# EasyEDA Pro project STM32F722.eprj, schematic InFlight P1
Board Name: Board1; Create Date: 2025-01-12; Page Name: Internal Schematic; Project Name: STM32F722; Schematic Name: InFlight P1; Update Date: 2025-01-13; Company: EASY EDA; Page Size: A4; Version: V1.0
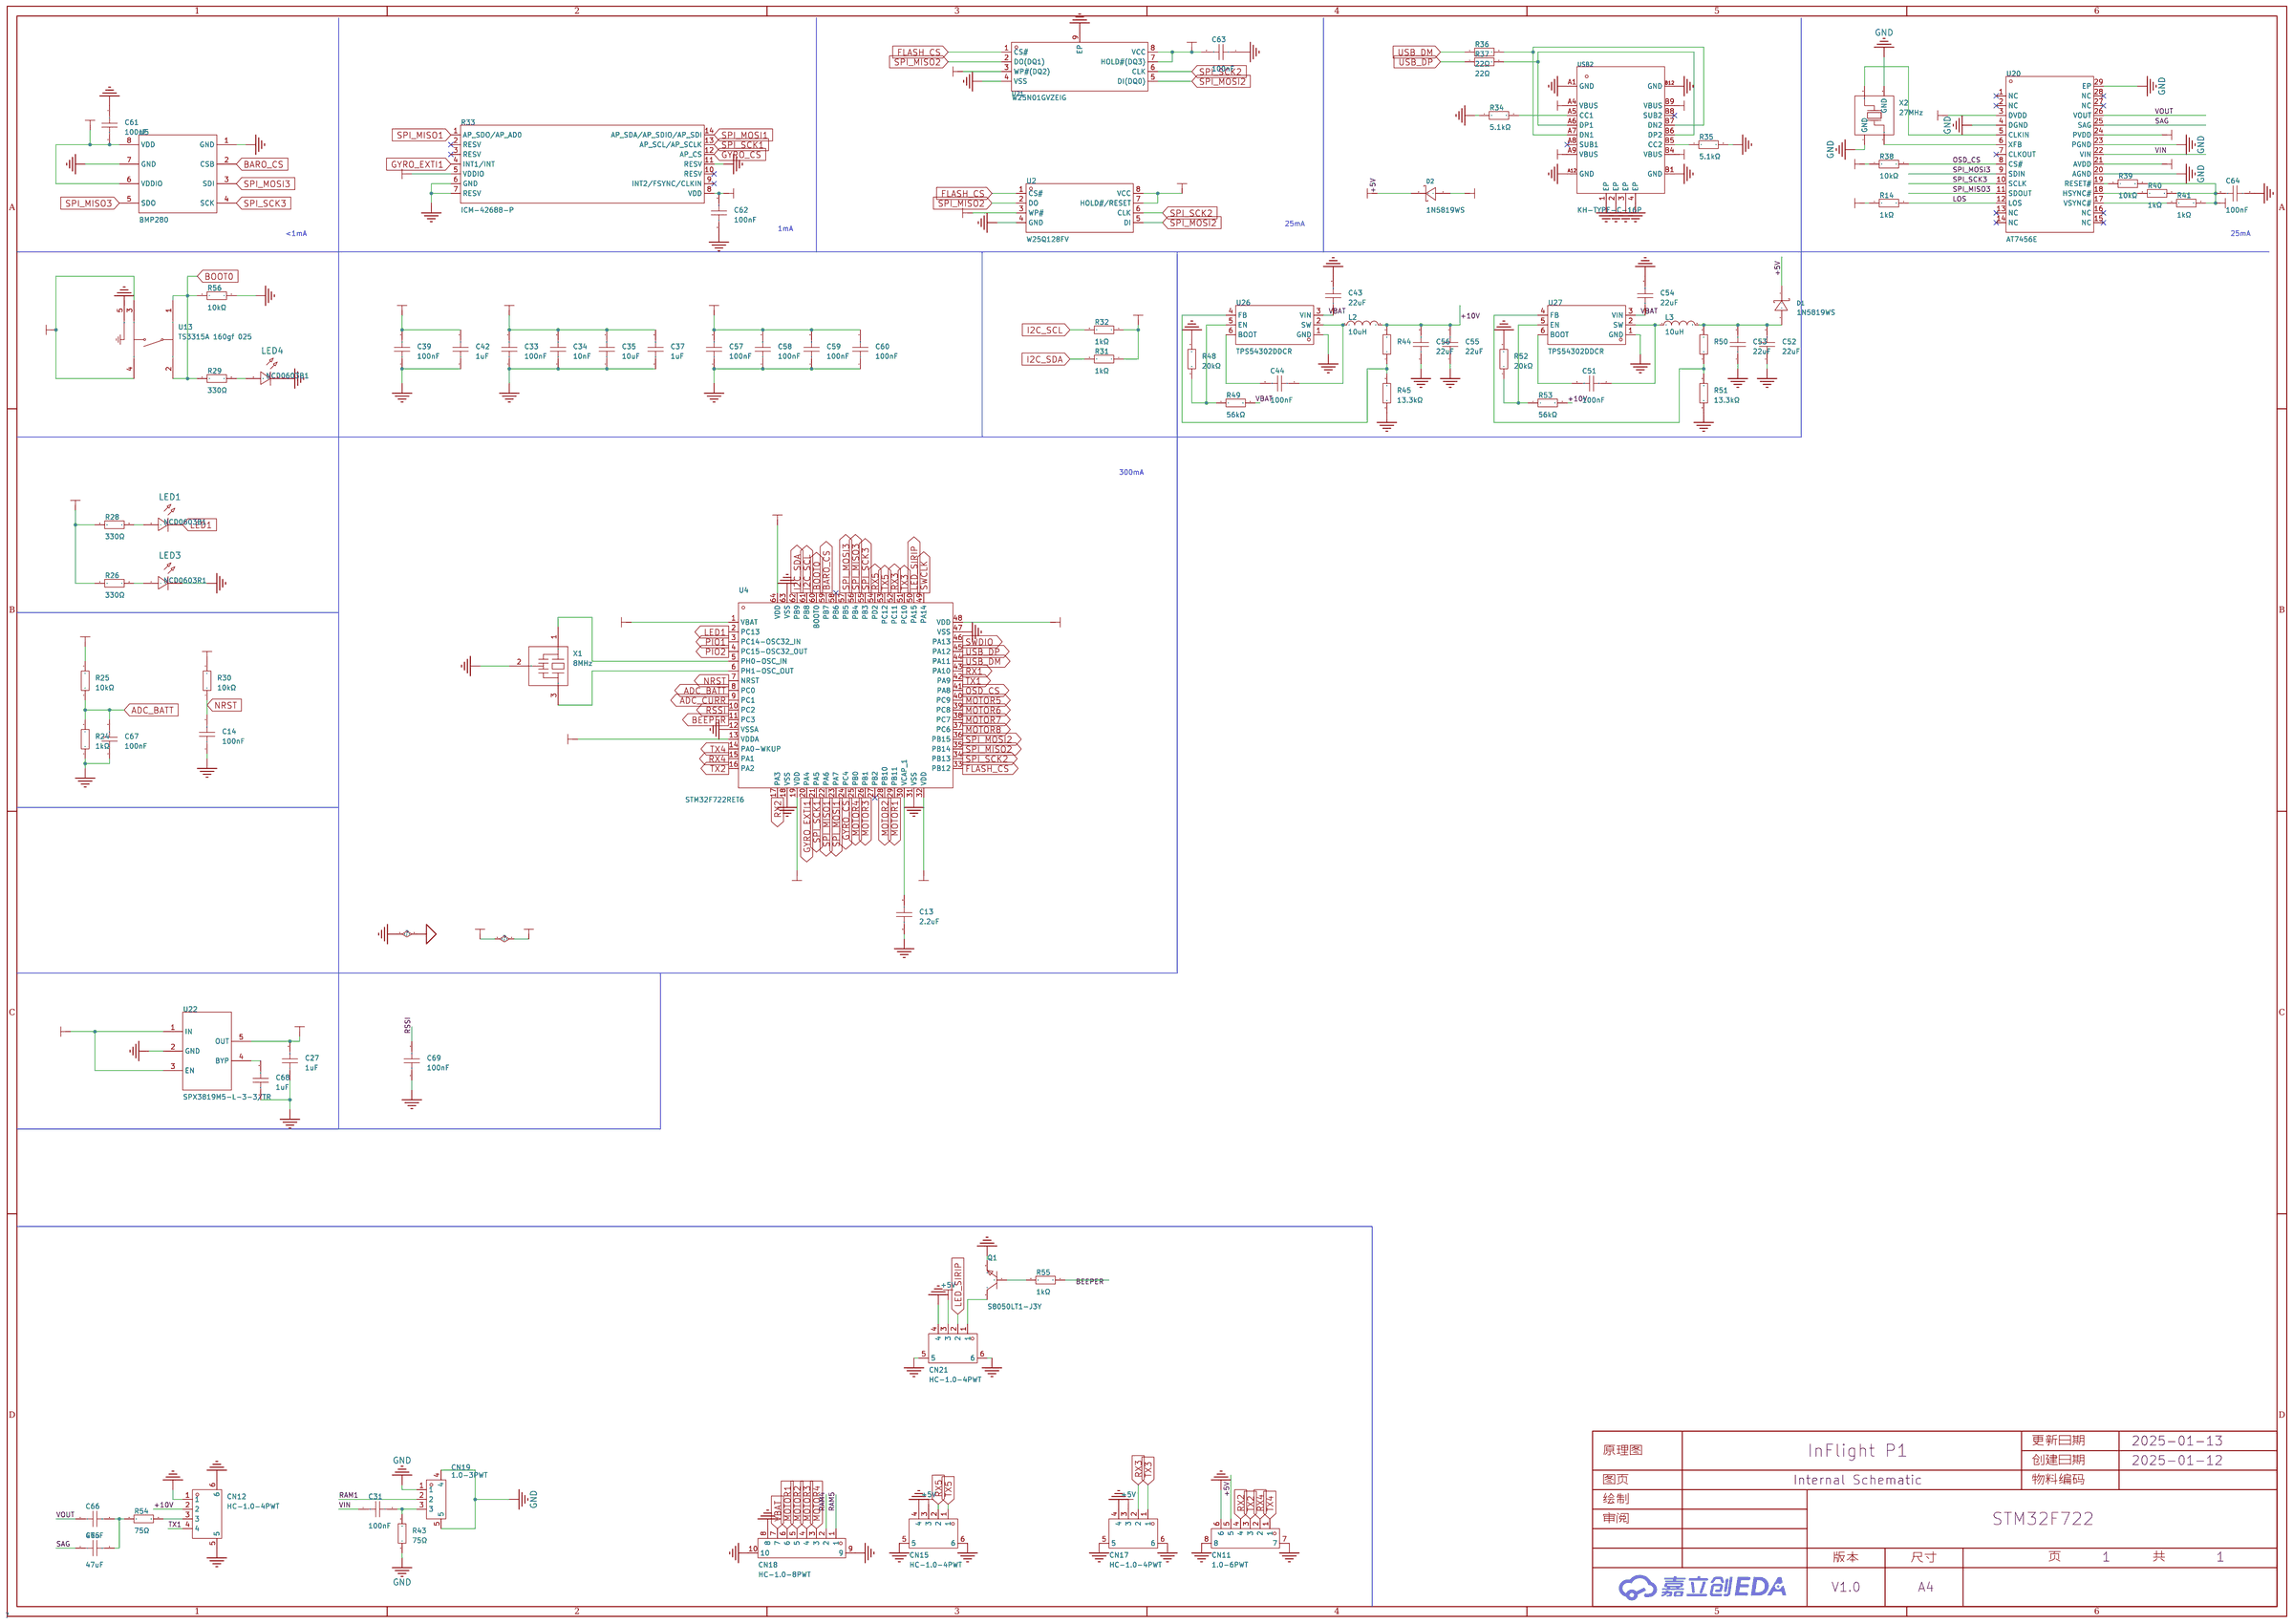
[diagram p0: schematic sheet]

## Parts
C13  2.2uF  [C0402]
C14  100nF  [C0402]
C27  1uF  [C0402]
C31  100nF  [C0402]
C33  100nF  [C0402]
C34  10nF  [C0402]
C35  10uF  [C0402]
C37  1uF  [C0402]
C39  100nF  [C0402]
C42  1uF  [C0402]
C43  22uF  [C0805]
C44  100nF  [C0402]
C51  100nF  [C0402]
C52  22uF  [C0603]
C53  22uF  [C0603]
C54  22uF  [C0805]
C55  22uF  [C0805]
C56  22uF  [C0805]
C57  100nF  [C0402]
C58  100nF  [C0402]
C59  100nF  [C0402]
C60  100nF  [C0402]
C61  100nF  [C0402]
C62  100nF  [C0402]
C63  100nF  [C0402]
C64  100nF  [C0402]
C65  47uF  [C1206]
C66  47uF  [C1206]
C67  100nF  [C0402]
C68  1uF  [C0402]
C69  100nF  [C0402]
CN11  1.0-6PWT  [CONN-SMD_1.0-6PWT]
CN12  HC-1.0-4PWT  [CONN-SMD_4P-P1.00_HCTL_HC-1.0-4PWT]
CN15  HC-1.0-4PWT  [CONN-SMD_4P-P1.00_HCTL_HC-1.0-4PWT]
CN17  HC-1.0-4PWT  [CONN-SMD_4P-P1.00_HCTL_HC-1.0-4PWT]
CN18  HC-1.0-8PWT  [CONN-SMD_HC-1.0-8PWT]
CN19  1.0-3PWT  [CONN-SMD_1.0-3PWT]
CN21  HC-1.0-4PWT  [CONN-SMD_4P-P1.00_HCTL_HC-1.0-4PWT]
D1  1N5819WS  [SOD-323_L1.8-W1.3-LS2.5-RD]
D2  1N5819WS  [SOD-323_L1.8-W1.3-LS2.5-RD]
L2  10uH  [IND-SMD_L4.4-W4.2]
L3  10uH  [IND-SMD_L4.4-W4.2]
LED1  NCD0603B1  [LED0603-RD]
LED3  NCD0603R1  [LED0603-RD_RED]
LED4  NCD0603B1  [LED0603-RD]
Q1  S8050LT1-J3Y  [SOT-23_L2.9-W1.3-P1.90-LS2.4-BR]
R14  1kΩ  [R0402]
R24  1kΩ  [R0402]
R25  10kΩ  [R0402]
R26  330Ω  [R0402]
R28  330Ω  [R0402]
R29  330Ω  [R0402]
R30  10kΩ  [R0402]
R31  1kΩ  [R0402]
R32  1kΩ  [R0402]
R33  ICM-42688-P  [LGA-14_L3.0-W2.5-P0.50-TL]
R34  5.1kΩ  [R0402]
R35  5.1kΩ  [R0402]
R36  22Ω  [R0402]
R37  22Ω  [R0402]
R38  10kΩ  [R0402]
R39  10kΩ  [R0402]
R40  1kΩ  [R0402]
R41  1kΩ  [R0402]
R43  75Ω  [R0402]
R44  200kΩ  [R0402]
R45  13.3kΩ  [R0402]
R48  20kΩ  [R0402]
R49  56kΩ  [R0402]
R50  100kΩ  [R0402]
R51  13.3kΩ  [R0402]
R52  20kΩ  [R0402]
R53  56kΩ  [R0402]
R54  75Ω  [R0402]
R55  1kΩ  [R0402]
R56  10kΩ  [R0402]
U2  W25Q128FV  [SOIC-8_L5.3-W5.3-P1.27-LS8.0-BL]  (no BOM)
U4  STM32F722RET6  [LQFP-64_L10.0-W10.0-P0.50-LS12.0-BL]
U5  BMP280  [LGA-8_L2.5-W2.0-P0.65_AMP6127]
U13  TS3315A 160gf 025  [SW-SMD_4P-L3.4-W3.4-P2.00-LS4.0_TS3315A160GF]
U20  AT7456E  [TSSOP-28_L9.7-W4.4-P0.65-LS6.4-BL-EP-2]
U21  W25N01GVZEIG  [WSON-8_L8.0-W6.10-P1.27-BL-EP]
U22  SPX3819M5-L-3-3/TR  [SOT-23-5_L3.0-W1.7-P0.95-LS2.8-BL]
U26  TPS54302DDCR  [SOT-23-6_L2.9-W1.6-P0.95-LS2.8-BL]
U27  TPS54302DDCR  [SOT-23-6_L2.9-W1.6-P0.95-LS2.8-BL]
USB2  KH-TYPE-C-16P  [USB-C-SMD_KH-TYPE-C-16P]
X1  8MHz  [OSC-SMD_3P-L3.2-W1.3-P1.2-L]
X2  27MHz  [OSC-SMD_4P-L3.2-W2.5-BL]

## Library data of the parts
C13 = CL05A225MQ5NSNC: 容值:2.2uF;精度:±20%;额定电压:6.3V;材质(温度系数):X5R;; LCSC Part Name: 2.2uF ±20% 6.3V; Supplier Part: C12530; Manufacturer: SAMSUNG(三星); Supplier Footprint: 0402; JLCPCB Part Class: Basic Part; Datasheet: https://atta.szlcsc.com/upload/public/pdf/source/20160103/1457707666860.pdf; Supplier: LCSC; Tolerance: ±20%; Voltage Rated: 6.3V; Temperature Coefficient: X5R
C14 C31 C33 C39 C44 C51 C57-C64 C67 C69 = CC0402KRX7R7BB104: 容值:100nF;精度:±10%;额定电压:16V;材质(温度系数):X7R;; LCSC Part Name: 100nF ±10% 16V; Supplier Part: C60474; Manufacturer: YAGEO(国巨); Supplier Footprint: 0402; JLCPCB Part Class: Extended Part; Datasheet: https://atta.szlcsc.com/upload/public/pdf/source/20211223/9278FD768280B81DDBEF48FA36411A03.pdf; Supplier: LCSC; Tolerance: ±10%; Voltage Rated: 16V; Temperature Coefficient: X7R
C27 C37 C42 C68 = CL05A105KP5NNNC: 容值:1uF;精度:±10%;额定电压:10V;材质(温度系数):X5R;; LCSC Part Name: 1uF ±10% 10V; Supplier Part: C14445; Manufacturer: SAMSUNG(三星); Supplier Footprint: 0402; JLCPCB Part Class: Extended Part; Datasheet: https://atta.szlcsc.com/upload/public/pdf/source/20160103/1457707670698.pdf; Supplier: LCSC; Tolerance: ±10%; Voltage Rated: 10V; Temperature Coefficient: X5R
C34 = CC0402KRX7R9BB103: 容值:10nF;精度:±10%;额定电压:50V;材质(温度系数):X7R;; LCSC Part Name: 10nF ±10% 50V; Supplier Part: C60133; Manufacturer: YAGEO(国巨); Supplier Footprint: 0402; JLCPCB Part Class: Extended Part; Datasheet: https://atta.szlcsc.com/upload/public/pdf/source/20180224/C181747_15194369449651363981.pdf; Supplier: LCSC; Tolerance: ±10%; Voltage Rated: 50V; Temperature Coefficient: X7R
C35 = CL05A106MQ5NUNC: 容值:10uF;精度:±20%;额定电压:6.3V;材质(温度系数):X5R;; LCSC Part Name: 10uF ±20% 6.3V; Supplier Part: C15525; Manufacturer: SAMSUNG(三星); Supplier Footprint: 0402; JLCPCB Part Class: Basic Part; Datasheet: https://atta.szlcsc.com/upload/public/pdf/source/20220823/2B02EE04F8F211D38A52DCB16EB6BEBA.pdf; Supplier: LCSC; Tolerance: ±20%; Voltage Rated: 6.3V; Temperature Coefficient: X5R
C43 C54-C56 = CGA0805X5R226M350MT: 容值:22uF;精度:±20%;额定电压:35V;材质(温度系数):X5R;; LCSC Part Name: 22uF ±20% 35V; Supplier Part: C6119901; Manufacturer: HRE(芯声); Supplier Footprint: 0805; JLCPCB Part Class: Extended Part; Datasheet: https://atta.szlcsc.com/upload/public/pdf/source/20160218/1457707763339.pdf; Supplier: LCSC; Tolerance: ±20%; Voltage Rated: 35V; Temperature Coefficient: X5R
C52 C53 = CL10A226MO7JZNC: 容值:22uF;精度:±20%;额定电压:16V;材质(温度系数):X5R;; LCSC Part Name: 22uF ±20% 16V; Supplier Part: C2762594; Manufacturer: SAMSUNG(三星); Supplier Footprint: 0603; JLCPCB Part Class: Extended Part; Datasheet: https://atta.szlcsc.com/upload/public/pdf/source/20220811/0832C3B1C642040B023B7A6186895861.pdf; Supplier: LCSC; Tolerance: ±20%; Voltage Rated: 16V; Temperature Coefficient: X5R
C65 C66 = CL31A476MQHNNNE: 容值:47uF;精度:±20%;额定电压:6.3V;温度系数:X5R;; LCSC Part Name: 47uF ±20% 6.3V; Supplier Part: C68361; Manufacturer: SAMSUNG(三星); Supplier Footprint: 1206; JLCPCB Part Class: Extended Part; Datasheet: https://atta.szlcsc.com/upload/public/pdf/source/20161108/1478586405199.pdf; Supplier: LCSC; Tolerance: ±20%; Voltage Rated: 6.3V; Temperature Coefficient: X5R
CN11 = 1.0-6PWT: LCSC Part Name: 6P 1mm; Supplier Part: C2763616; Manufacturer: FG(富港); Supplier Footprint: SMD; JLCPCB Part Class: 扩展库; Datasheet: https://atta.szlcsc.com/upload/public/pdf/source/20210407/C2763612_BC19A2888F3D57031C069552FCD34E66.pdf; Supplier: LCSC
CN12 CN15 CN17 CN21 = HC-1.0-4PWT: 参考系列:-;间距:1mm;插针结构:1x4P;排数:1;每排PIN数:4;行距:-;公母:公型插针;安装方式:卧贴;额定电流:500mA;工作温度范围:-25℃~+85℃;; LCSC Part Name: 1mm 1x4P 卧贴; Supplier Part: C2845363; Manufacturer: HCTL(华灿天禄); Supplier Footprint: SMD,P=1mm; JLCPCB Part Class: 扩展库; Datasheet: https://atta.szlcsc.com/upload/public/pdf/source/20210728/C2845363_1F51BFD94B9715F37EC2DCD7F6BA530B.pdf; Supplier: LCSC; Pitch: 1mm; Pins Structure: 1x4P; Number of Rows: 1; Number of PINs Per Row: 4; Gender: 公型插针; Mounting Style: 卧贴; Current Rating (Max): 500mA; Operating Temperature Range: -25℃~+85℃
CN18 = HC-1.0-8PWT: 插针结构:1x8P;间距:1mm;公母:公;安装方式:卧贴;行距:-;排数:1;每排PIN数:8;参考系列:-;额定电流:500mA;工作温度范围:-25℃~+85℃;; LCSC Part Name: 1x8P 间距:1mm 卧贴; Supplier Part: C2845367; Manufacturer: HCTL(华灿天禄); Supplier Footprint: SMD,P=1mm; JLCPCB Part Class: 扩展库; Datasheet: https://atta.szlcsc.com/upload/public/pdf/source/20230707/696F47DD5B3D5495B4AB8BCE302E8A84.pdf; Supplier: LCSC; Pins Structure: 1x8P; Pitch: 1mm; Gender: 公; Mounting Style: 卧贴; Number of Rows: 1; Number of PINs Per Row: 8; Current Rating (Max): 500mA; Operating Temperature Range: -25℃~+85℃
CN19 = 1.0-3PWT: LCSC Part Name: 3P 1mm; Supplier Part: C2763613; Manufacturer: FG(富港); Supplier Footprint: SMD; JLCPCB Part Class: 扩展库; Datasheet: https://atta.szlcsc.com/upload/public/pdf/source/20210407/C2763612_BC19A2888F3D57031C069552FCD34E66.pdf; Supplier: LCSC
D1 D2 = 1N5819WS_C191023: 直流反向耐压(Vr):40V;平均整流电流(Io):1A;正向压降(Vf):600mV@1A;; Supplier Part: C191023; Manufacturer: Hottech(合科泰); Supplier Footprint: SOD-323; JLCPCB Part Class: Extended Part; Datasheet: https://atta.szlcsc.com/upload/public/pdf/source/20180614/C191023_3C6A6398B911F3A4C23E7538EE054643.pdf; Supplier: LCSC; Reverse Voltage (Vr): 40V; Average Rectified Current (Io): 1A; Forward Voltage (Vf@If): 600mV@1A
L2 L3 = FAUL0420-100MT: 电感值:10uH;精度:±20%;额定电流:1.6A;类型:一体成型电感;饱和电流(Isat):2A;; LCSC Part Name: 10uH ±20% 2A; Supplier Part: C3040387; Manufacturer: cjiang(长江微电); Supplier Footprint: SMD,4.2x4.4mm; JLCPCB Part Class: 扩展库; Datasheet: https://atta.szlcsc.com/upload/public/pdf/source/20221201/43419F042EC034C99E4B70E898E2F3B3.pdf; Supplier: LCSC; Tolerance: ±20%; Rated Current: 1.6A; Type: 一体成型电感; DC Resistance (DCR): 282mΩ; Saturation Current (Isat): 2A; Ratings: AEC-Q200
LED1 LED4 = NCD0603B1: 发光颜色:蓝色;功率:72mW;透镜颜色:无色透明;主波长:463nm~475nm;发光强度:80mcd~220mcd;发光角度:130°;工作温度:-30℃~+85℃;; LCSC Part Name: 蓝灯 0603蓝灯   正贴; Supplier Part: C84266; Manufacturer: 国星光电; Supplier Footprint: 0603; JLCPCB Part Class: Extended Part; Datasheet: https://atta.szlcsc.com/upload/public/pdf/source/20200820/C84266_6A3CDBEFA72C6CAD68EDA53474ADAE6C.pdf; Supplier: LCSC; Emitted Color: 蓝色; Forward Voltage (VF): 2.6V~3.6V; Forward Current: 10mA; Power Dissipation: 72mW; Lens Color: 无色透明; Dominant Wavelength: 463nm~475nm; Luminous Intensity: 80mcd~220mcd; Viewing Angle: 130°; Operating Temperature: -30℃~+85℃
LED3 = NCD0603R1_C84263: 发光颜色:红色;功率:65mW;透镜颜色:无色透明;主波长:615nm~630nm;发光强度:80mcd~220mcd;发光角度:130°;工作温度:-30℃~+85℃;; LCSC Part Name: 红灯 0603红灯   正贴; Supplier Part: C84263; Manufacturer: 国星光电; Supplier Footprint: 0603; JLCPCB Part Class: Extended Part; Datasheet: https://atta.szlcsc.com/upload/public/pdf/source/20200820/C84263_DABC6A75E58F576973B407FDBA283D60.pdf; Supplier: LCSC; Emitted Color: 红色; Forward Voltage (VF): 1.6V~2.6V; Forward Current: 20mA; Power Dissipation: 65mW; Lens Color: 无色透明; Dominant Wavelength: 615nm~630nm; Luminous Intensity: 80mcd~220mcd; Viewing Angle: 130°; Operating Temperature: -30℃~+85℃
Q1 = S8050LT1-J3Y: Supplier Part: C2962087; Manufacturer: FH(风华); Supplier Footprint: SOT-23; JLCPCB Part Class: 扩展库; Datasheet: https://atta.szlcsc.com/upload/public/pdf/source/20220411/740B3F4857AB400E9826209E74F1EDA4.pdf; Supplier: LCSC
R14 R24 R31 R32 R40 R41 R55 = 0402WGF1001TCE: 阻值:1kΩ;精度:±1%;功率:62.5mW;温度系数:±100ppm/℃;电阻类型:厚膜电阻;; LCSC Part Name: 1kΩ ±1% 62.5mW 厚膜电阻; Supplier Part: C11702; Manufacturer: UNI-ROYAL(厚声); Supplier Footprint: 0402; JLCPCB Part Class: Basic Part; Datasheet: https://atta.szlcsc.com/upload/public/pdf/source/20200306/C422600_1E6D84923E4A46A82E41ADD87F860B5C.pdf; Supplier: LCSC; Tolerance: ±1%; Power(Watts): 62.5mW; Overload Voltage (Max): 50V; Temperature Coefficient: ±100ppm/℃; Type: 厚膜电阻; Operating Temperature Range: -55℃~+155℃
R25 R30 R38 R39 R56 = 0402WGF1002TCE: 阻值:10kΩ;精度:±1%;功率:62.5mW;温度系数:±100ppm/℃;电阻类型:厚膜电阻;; LCSC Part Name: 10kΩ ±1% 62.5mW 厚膜电阻; Supplier Part: C25744; Manufacturer: UNI-ROYAL(厚声); Supplier Footprint: 0402; JLCPCB Part Class: Basic Part; Datasheet: https://atta.szlcsc.com/upload/public/pdf/source/20200306/C422600_1E6D84923E4A46A82E41ADD87F860B5C.pdf; Supplier: LCSC; Tolerance: ±1%; Power(Watts): 62.5mW; Overload Voltage (Max): 50V; Temperature Coefficient: ±100ppm/℃; Type: 厚膜电阻; Operating Temperature Range: -55℃~+155℃
R26 R28 R29 = 0402WGJ0331TCE: 阻值:330Ω;精度:±5%;功率:62.5mW;温度系数:±100ppm/℃;电阻类型:厚膜电阻;; LCSC Part Name: 330Ω ±5% 62.5mW 厚膜电阻; Supplier Part: C12246; Manufacturer: UNI-ROYAL(厚声); Supplier Footprint: 0402; JLCPCB Part Class: Extended Part; Datasheet: https://atta.szlcsc.com/upload/public/pdf/source/20200306/C422600_1E6D84923E4A46A82E41ADD87F860B5C.pdf; Supplier: LCSC; Tolerance: ±5%; Power(Watts): 62.5mW; Overload Voltage (Max): 50V; Temperature Coefficient: ±100ppm/℃; Type: 厚膜电阻; Operating Temperature Range: -55℃~+155℃
R33 = ICM-42688-P: LCSC Part Name: ICM 42688 P; Supplier Part: C1850418; Manufacturer: TDK InvenSense(应美盛); Supplier Footprint: LGA-14(2.5x3); JLCPCB Part Class: 扩展库; Datasheet: https://atta.szlcsc.com/upload/public/pdf/source/20210703/CF24204867ACE5B754A2B035F23E5931.pdf; Supplier: LCSC
R34 R35 = 0402WGF5101TCE: 阻值:5.1kΩ;精度:±1%;功率:62.5mW;温度系数:±100ppm/℃;电阻类型:厚膜电阻;; LCSC Part Name: 5.1kΩ ±1% 62.5mW 厚膜电阻; Supplier Part: C25905; Manufacturer: UNI-ROYAL(厚声); Supplier Footprint: 0402; JLCPCB Part Class: Basic Part; Datasheet: https://atta.szlcsc.com/upload/public/pdf/source/20200306/C422600_1E6D84923E4A46A82E41ADD87F860B5C.pdf; Supplier: LCSC; Tolerance: ±1%; Power(Watts): 62.5mW; Overload Voltage (Max): 50V; Temperature Coefficient: ±100ppm/℃; Type: 厚膜电阻; Operating Temperature Range: -55℃~+155℃
R36 R37 = 0402WGF220JTCE: 阻值:22Ω;精度:±1%;功率:62.5mW;温度系数:±100ppm/℃;电阻类型:厚膜电阻;; LCSC Part Name: 22Ω ±1% 62.5mW 厚膜电阻; Supplier Part: C25092; Manufacturer: UNI-ROYAL(厚声); Supplier Footprint: 0402; JLCPCB Part Class: Basic Part; Datasheet: https://atta.szlcsc.com/upload/public/pdf/source/20200306/C422600_1E6D84923E4A46A82E41ADD87F860B5C.pdf; Supplier: LCSC; Tolerance: ±1%; Power(Watts): 62.5mW; Overload Voltage (Max): 50V; Temperature Coefficient: ±100ppm/℃; Type: 厚膜电阻; Operating Temperature Range: -55℃~+155℃
R43 R54 = WR04X75R0FTL: 阻值:75Ω;精度:±1%;功率:62.5mW;温度系数:±100ppm/℃;最大工作电压:50V;工作温度范围:-55℃~+155℃;; LCSC Part Name: 75Ω ±1% 62.5mW; Supplier Part: C168249; Manufacturer: Walsin(华新科); Supplier Footprint: 0402; JLCPCB Part Class: Extended Part; Supplier: LCSC; Tolerance: ±1%; Power(Watts): 62.5mW; Temperature Coefficient: ±100ppm/℃; Overload Voltage (Max): 50V; Operating Temperature Range: -55℃~+155℃
R44 = 0402WGF2003TCE: 阻值:200kΩ;精度:±1%;功率:62.5mW;温度系数:±100ppm/℃;电阻类型:厚膜电阻;; LCSC Part Name: 200kΩ ±1% 62.5mW 厚膜电阻; Supplier Part: C25764; Manufacturer: UNI-ROYAL(厚声); Supplier Footprint: 0402; JLCPCB Part Class: Basic Part; Datasheet: https://atta.szlcsc.com/upload/public/pdf/source/20200306/C422600_1E6D84923E4A46A82E41ADD87F860B5C.pdf; Supplier: LCSC; Tolerance: ±1%; Power(Watts): 62.5mW; Overload Voltage (Max): 50V; Temperature Coefficient: ±100ppm/℃; Type: 厚膜电阻; Operating Temperature Range: -55℃~+155℃
R45 R51 = AC0402DR-0713K3L: 电阻类型:厚膜电阻;阻值:13.3kΩ;精度:±0.5%;功率:62.5mW;温度系数:±100ppm/℃;; LCSC Part Name: 厚膜电阻 13.3kΩ ±0.5% 62.5mW; Supplier Part: C226686; Manufacturer: YAGEO(国巨); Supplier Footprint: 0402; JLCPCB Part Class: Extended Part; Datasheet: https://atta.szlcsc.com/upload/public/pdf/source/20190301/C230000_FEACA6AA45ADCA89EA12E4E744ACE6F2.pdf; Supplier: LCSC; Type: 厚膜电阻; Tolerance: ±0.5%; Power(Watts): 62.5mW; Temperature Coefficient: ±100ppm/℃; Overload Voltage (Max): 50V; Operating Temperature Range: -55℃~+155℃
R48 R52 = 0402WGF2002TCE: 阻值:20kΩ;精度:±1%;功率:62.5mW;温度系数:±100ppm/℃;电阻类型:厚膜电阻;; LCSC Part Name: 20kΩ ±1% 62.5mW 厚膜电阻; Supplier Part: C25765; Manufacturer: UNI-ROYAL(厚声); Supplier Footprint: 0402; JLCPCB Part Class: Basic Part; Datasheet: https://atta.szlcsc.com/upload/public/pdf/source/20200306/C422600_1E6D84923E4A46A82E41ADD87F860B5C.pdf; Supplier: LCSC; Tolerance: ±1%; Power(Watts): 62.5mW; Overload Voltage (Max): 50V; Temperature Coefficient: ±100ppm/℃; Type: 厚膜电阻; Operating Temperature Range: -55℃~+155℃
R49 R53 = RC0402FR-0756KL: 电阻类型:厚膜电阻;阻值:56kΩ;精度:±1%;功率:62.5mW;; LCSC Part Name: 56kΩ ±1% 62.5mW; Supplier Part: C114756; Manufacturer: YAGEO(国巨); Supplier Footprint: 0402; JLCPCB Part Class: Extended Part; Datasheet: https://atta.szlcsc.com/upload/public/pdf/source/20170912/C114756_1505207814158963474.pdf; Supplier: LCSC; Type: 厚膜电阻; Tolerance: ±1%; Power(Watts): 62.5mW; Temperature Coefficient: ±100ppm/℃; Overload Voltage (Max): 50V; Operating Temperature Range: -55℃~+155℃
R50 = 0402WGF1003TCE: 阻值:100kΩ;精度:±1%;功率:62.5mW;温度系数:±100ppm/℃;电阻类型:厚膜电阻;; LCSC Part Name: 100kΩ ±1% 62.5mW 厚膜电阻; Supplier Part: C25741; Manufacturer: UNI-ROYAL(厚声); Supplier Footprint: 0402; JLCPCB Part Class: Basic Part; Datasheet: https://atta.szlcsc.com/upload/public/pdf/source/20200306/C422600_1E6D84923E4A46A82E41ADD87F860B5C.pdf; Supplier: LCSC; Tolerance: ±1%; Power(Watts): 62.5mW; Overload Voltage (Max): 50V; Temperature Coefficient: ±100ppm/℃; Type: 厚膜电阻; Operating Temperature Range: -55℃~+155℃
U2 = W25Q128FV: Supplier Part: C9900003156; JLCPCB Part Class: 扩展库; Datasheet: 2021-11-30/1610504A/f9dbbc54200346fda97ad0907653c3a2/D21112500478.pdf; Supplier: LCSC
U4 = STM32F722RET6: CPU内核:ARM-M系列;CPU最大主频:216MHz;程序存储容量:512KB;程序存储器类型:FLASH;RAM总容量:256KB;GPIO端口数量:50;; LCSC Part Name: ARM-M系列 216MHz; Supplier Part: C118207; Manufacturer: ST(意法半导体); Supplier Footprint: LQFP-64(10x10); JLCPCB Part Class: 扩展库; Datasheet: https://atta.szlcsc.com/upload/public/pdf/source/20180326/C118207_DCEB6DA8BB909C83A57FA6AD6241247E.pdf; Supplier: LCSC; CPU Core: ARM-M系列; CPU Maximum Speed: 216MHz; Operating Voltage Range: 1.7V~3.6V; Program Storage Size: 512KB; Program Memory Type: FLASH; RAM Size: 256KB; GPIO Ports Number: 50; ADC (Bit): 12bit; DAC (Bit): 12bit; Peripheral/Function: DMA；PWM; Internal Oscillator: 有; Operating Temperature Range: -40℃~+85℃
U5 = BMP280: Bosch气压传感器新品，可测量大气压力，带高精度温度测量，可校准精确计算海拔高度。I2C或SPI接口，宽量程（300-1100hpa），精度高; Supplier Part: C83291; Manufacturer: Bosch(博世); Supplier Footprint: LGA-8(2x2.5); JLCPCB Part Class: 扩展库; Datasheet: https://atta.szlcsc.com/upload/public/pdf/source/20200702/C83291_F39E84AB7DFC569A4C7554F8659640A1.pdf; Supplier: LCSC
U13 = TS3315A 160gf 025: 触点电流：50mA 额定电压(DC)：12V 电路结构：单刀单掷 安装方式：立贴 按钮形状：圆形按钮 作用力：160gf±30gf 机械寿命：100000 工作温度：-30℃~+80℃ 开关长度：3.3mm 开关宽度：3.3mm 开关高度：1.5mm; LCSC Part Name: 3*3*1.5mm 四脚贴片 160gf不锈钢; Supplier Part: C5373425; Manufacturer: SHOU HAN(首韩); Supplier Footprint: SMD; Datasheet: https://atta.szlcsc.com/upload/public/pdf/source/20230321/D88CDF2C2FC55C1F5AF306EDD5E838E4.pdf; Supplier: LCSC
U20 = AT7456E: 视频字符叠加芯片，跟MAX7456-pin-pin; Supplier Part: C82351; Manufacturer: 杭州中科微; Supplier Footprint: TSSOP-28; JLCPCB Part Class: Extended Part; Datasheet: https://atta.szlcsc.com/upload/public/pdf/source/20180326/C82351_A40539A53E8345C88178541014FDE5FB.pdf; Supplier: LCSC
U21 = W25N01GVZEIG_C907645: Supplier Part: C907645; Manufacturer: WINBOND(华邦); Supplier Footprint: WSON-8-EP(6.1x8); JLCPCB Part Class: 扩展库; Datasheet: https://atta.szlcsc.com/upload/public/pdf/source/20201021/C907645_0A29D2C383E097D6F46BF0FEEFAA9DEB.pdf; Supplier: LCSC
U22 = SPX3819M5-L-3-3/TR: 输出类型:固定;输出极性:正;最大输入电压:16V;输出电压:3.3V;输出电流:500mA;电源纹波抑制比(PSRR):70dB;; LCSC Part Name: 输入16V 输出3.3V 500mA; Supplier Part: C9055; Manufacturer: MaxLinear; Supplier Footprint: SOT-23-5; JLCPCB Part Class: 扩展库; Datasheet: https://atta.szlcsc.com/upload/public/pdf/source/20150720/1457707331934.pdf; Supplier: LCSC; Output Type: 固定; Output Polarity: 正; Number of Outputs: 1; Maximum Input Voltage: 16V; Output Voltage: 3.3V; Dropout Voltage: 700mV@(500mA); Quiescent Current (Ground Current): 8uA; Output Current: 500mA; Power Supply Rejection Ratio (PSRR): 70dB; Operating Temperature: -40℃~+125℃
U26 U27 = TPS54302DDCR: 功能类型:降压型;输出类型:可调;输入电压:4.5V~28V;输出电压:596mV~28V;输出电流(最大值):3A;; LCSC Part Name: 降压型 输入4.5V~28V 输出596mV~28V 3A; Supplier Part: C311983; Manufacturer: TI(德州仪器); Supplier Footprint: TSOT-23-6; JLCPCB Part Class: 扩展库; Datasheet: https://atta.szlcsc.com/upload/public/pdf/source/20181023/C311983_0948EE70BFAD2011B492BD3F4CEA709D.pdf; Supplier: LCSC; Function: 降压型; Synchronous Rectification: 是; Output Type: 可调; Number of Outputs: 1; Topology: 降压式; Input Voltage: 4.5V~28V; Output Voltage: 596mV~28V; Output Current (Max): 3A; Switching Frequency: 400kHz; Operating Temperature: -40℃~+125℃@(TJ)
USB2 = KH-TYPE-C-16P: Type-C母座 16PIN 立式四角贴板无压片; LCSC Part Name: Type-C母座; Supplier Part: C709357; Manufacturer: kinghelm(金航标); JLCPCB Part Class: 扩展库; Supplier: LCSC
X1 = CSTCE8M00G55-R0: 频率:8MHz;频率容差:±0.5%;内置负载电容:33pF;谐振阻抗:-;; LCSC Part Name: 8M ±0.5% 33pF 停产; Supplier Part: C70457; Manufacturer: muRata(村田); Supplier Footprint: SMD3213-3P; JLCPCB Part Class: 扩展库; Datasheet: https://atta.szlcsc.com/upload/public/pdf/source/20160405/1459820110299.pdf; Supplier: LCSC; Frequency Stability: ±0.2%; Frequency Tolerance: ±0.5%; Built-in Load Capacitance: 33pF; Operating Temperature: -20℃~+80℃
X2 = X1E000021015800: 频率:27MHz;晶振类型:贴片无源晶振;负载电容:10pF;等效串联电阻(ESR):40Ω;频率公差:±10ppm;频率稳定度:-;工作温度:-40℃~+85℃;; LCSC Part Name: TSX-3225 27MHz 10pF 10ppm; Supplier Part: C91748; Manufacturer: EPSON(爱普生); Supplier Footprint: SMD3225-4P; JLCPCB Part Class: Extended Part; Datasheet: https://atta.szlcsc.com/upload/public/pdf/source/20170103/1483439947812.pdf; Supplier: LCSC; Operating Temperature: -40℃~+85℃; Crystal Type: 贴片无源晶振; Load Capacitance: 10pF; Equivalent Series Resistance (ESR): 40Ω; Frequency Tolerance: ±10ppm

## Nets
+3.3V_1: C27.2 C33.2 C34.2 C35.2 C37.2 C39.2 C42.2 C57.2 C58.2 C59.2 C60.2 C61.2 C62.2 C63.2 C64.2 R14.1 R26.1 R28.1 R30.2 R31.1 R32.1 R33.5(VDDIO) R33.8(VDD) R38.1 R39.2 R40.2 R41.2 U2.3(WP#) U2.7(HOLD#/RESET) U2.8(VCC) U4.1(VBAT) U4.13(VDDA) U4.19(VDD) U4.32(VDD) U4.48(VDD) U4.64(VDD) U5.6(VDDIO) U5.8(VDD) U13.3(C) U13.4(D) U20.3(DVDD) U20.21(AVDD) U20.24(PVDD) U21.3(WP#(DQ2)) U21.7(HOLD#(DQ3)) U21.8(VCC) U22.5(OUT)
+5V: CN11.5 CN15.3 CN17.3 CN21.3 D1.1(K) D2.1(K) U22.1(IN) U22.3(EN)
+10V: C55.2 C56.2 CN12.2 L2.2 R44.2 R53.2
AGND: C13.1 C14.1 C27.1 C33.1 C34.1 C35.1 C37.1 C39.1 C42.1 C43.2 C52.1 C53.1 C54.2 C55.1 C56.1 C57.1 C58.1 C59.1 C60.1 C61.1 C62.1 C63.1 C64.1 C67.1 C68.1 C69.2 CN11.6 CN11.7 CN11.8 CN12.1 CN12.5 CN12.6 CN15.4 CN15.5 CN15.6 CN17.4 CN17.5 CN17.6 CN18.8 CN18.9 CN18.10 CN19.1 CN19.4 CN19.5 CN21.4 CN21.5 CN21.6 LED3.1(C) LED4.1(C) Q1.2 R24.1 R33.6(GND) R33.7(RESV) R33.11(RESV) R34.1 R35.2 R43.1 R45.1 R48.2 R51.1 R52.2 R56.1 U2.4(GND) U4.12(VSSA) U4.18(VSS) U4.31(VSS) U4.47(VSS) U4.63(VSS) U5.1(GND) U5.7(GND) U13.5(GND) U20.4(DGND) U20.20(AGND) U20.23(PGND) U20.29(EP) U21.4(VSS) U21.9(EP) U22.2(GND) U26.1(GND) U27.1(GND) USB2.1(EP) USB2.2(EP) USB2.3(EP) USB2.4(EP) USB2.A1(GND) USB2.A12(GND) USB2.B1(GND) USB2.B12(GND) X1.2(VSS) X2.2(GND) X2.4(GND)
VBAT: C43.1 C54.1 CN18.7 R25.2 R49.2 U26.3(VIN) U27.3(VIN)
VBUS: D2.2(A) USB2.A4(VBUS) USB2.A9(VBUS) USB2.B4(VBUS) USB2.B9(VBUS)
VIN: C31.1 U20.22(VIN)
ADC_BATT: C67.2 R24.2 R25.1 U4.8(PC0)
ADC_CURR: U4.9(PC1)
BARO_CS: U4.59(PB7) U5.2(CSB)
BEEPER: R55.1 U4.11(PC3)
BOOT0: R29.1 R56.2 U4.60(BOOT0) U13.1(A) U13.2(B)
FLASH_CS: U2.1(CS#) U4.33(PB12) U21.1(CS#)
GYRO_CS: R33.12(AP_CS) U4.24(PC4)
GYRO_EXTI1: R33.4(INT1/INT) U4.20(PA4)
I2C_SCL: R32.2 U4.61(PB8)
I2C_SDA: R31.2 U4.62(PB9)
LED1: LED1.1(C) U4.2(PC13)
LED_SIRIP: CN21.2 U4.50(PA15)
LOS: R14.2 U20.12(LOS)
MOTOR1: CN18.6 U4.29(PB11)
MOTOR2: CN18.5 U4.28(PB10)
MOTOR3: CN18.4 U4.26(PB1)
MOTOR4: CN18.3 U4.25(PB0)
MOTOR5: U4.40(PC9)
MOTOR6: U4.39(PC8)
MOTOR7: U4.38(PC7)
MOTOR8: U4.37(PC6)
NRST: C14.2 R30.1 U4.7(NRST)
OSD_CS: R38.2 U4.41(PA8) U20.8(CS#)
PIO1: U4.3(PC14-OSC32_IN)
PIO2: U4.4(PC15-OSC32_OUT)
RAM1: CN19.2
RAM4: CN18.2
RAM5: CN18.1
RSSI: C69.1 U4.10(PC2)
RX1: U4.43(PA10)
RX2: CN11.4 U4.17(PA3)
RX3: CN17.2 U4.52(PC11)
RX4: CN11.2 U4.15(PA1)
RX5: CN15.2 U4.54(PD2)
SAG: C65.1 U20.25(SAG)
SPI_MISO1: R33.1(AP_SDO/AP_AD0) U4.22(PA6)
SPI_MISO2: U2.2(DO) U4.35(PB14) U21.2(DO(DQ1))
SPI_MISO3: U4.56(PB4) U5.5(SDO) U20.11(SDOUT)
SPI_MOSI1: R33.14(AP_SDA/AP_SDIO/AP_SDI) U4.23(PA7)
SPI_MOSI2: U2.5(DI) U4.36(PB15) U21.5(DI(DQ0))
SPI_MOSI3: U4.57(PB5) U5.3(SDI) U20.9(SDIN)
SPI_SCK1: R33.13(AP_SCL/AP_SCLK) U4.21(PA5)
SPI_SCK2: U2.6(CLK) U4.34(PB13) U21.6(CLK)
SPI_SCK3: U4.55(PB3) U5.4(SCK) U20.10(SCLK)
SWCLK: U4.49(PA14)
SWDIO: U4.46(PA13)
TX1: CN12.4 U4.42(PA9)
TX2: CN11.3 U4.16(PA2)
TX3: CN17.1 U4.51(PC10)
TX4: CN11.1 U4.14(PA0-WKUP)
TX5: CN15.1 U4.53(PC12)
USB_DM: R36.1 U4.44(PA11)
USB_DP: R37.1 U4.45(PA12)
VOUT: C66.1 U20.26(VOUT)
$1N5315: C13.2 U4.30(VCAP_1)
$1N6274: LED3.2(A) R26.2
$1N6277: LED1.2(A) R28.2
$1N6597: LED4.2(A) R29.2
$1N6740: U4.5(PH0-OSC_IN) X1.1
$1N6754: U4.6(PH1-OSC_OUT) X1.3
$1N8449: R35.1 USB2.B5(CC2)
$1N8452: R34.2 USB2.A5(CC1)
$1N8750: R36.2 USB2.A7(DN1) USB2.B7(DN2)
$1N8765: R37.2 USB2.A6(DP1) USB2.B6(DP2)
$1N15437: U20.6(XFB) X2.1(OSC1)
$1N15438: U20.5(CLKIN) X2.3(OSC2)
$1N15463: R39.1 U20.19(RESET#)
$1N15464: R41.1 U20.17(VSYNC#)
$1N15465: R40.1 U20.18(HSYNC#)
$1N15786: C31.2 CN19.3 R43.2
$1N34361: C44.1 L2.1 U26.2(SW)
$1N34362: C44.2 U26.6(BOOT)
$1N34400: R44.1 R45.2 U26.4(FB)
$1N34492: R48.1 R49.1 U26.5(EN)
$1N34966: C52.2 C53.2 D1.2(A) L3.2 R50.2
$1N34973: C51.1 L3.1 U27.2(SW)
$1N34978: C51.2 U27.6(BOOT)
$1N34984: R50.1 R51.2 U27.4(FB)
$1N34994: R52.1 R53.1 U27.5(EN)
$1N42503: C65.2 C66.2 R54.1
$1N42504: CN12.3 R54.2
$1N48463: C68.2 U22.4(BYP)
$1N67638: Q1.1 R55.2
$1N67645: CN21.1 Q1.3

Not connected (* = marked no-connect by the designer): R33 2(RESV)* 3(RESV)* 9(INT2/FSYNC/CLKIN)* 10(RESV)*; U4 27(PB2)* 58(PB6)*; U20 1(NC)* 2(NC)* 7(CLKOUT)* 13(NC)* 14(NC)* 15(NC)* 16(NC)* 27(NC)* 28(NC)*; USB2 A8(SUB1)* B8(SUB2)*

## Notes on the sheet
- 25mA
- <1mA
- 1mA
- 25mA
- 300mA
